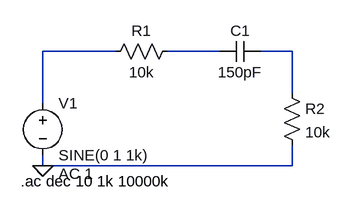
[diagram p0: schematic Draft1.asc]
Draft1.asc, the LTspice schematic file:
Version 4
SHEET 1 880 680
WIRE 16 -80 -96 -80
WIRE 176 -80 96 -80
WIRE 288 -80 240 -80
WIRE 288 -16 288 -80
WIRE -96 0 -96 -80
WIRE -96 96 -96 80
WIRE 288 96 288 64
WIRE 288 96 -96 96
FLAG -96 96 0
SYMBOL res 112 -96 R90
WINDOW 0 0 56 VBottom 2
WINDOW 3 32 56 VTop 2
SYMATTR InstName R1
SYMATTR Value 10k
SYMBOL res 272 -32 R0
SYMATTR InstName R2
SYMATTR Value 10k
SYMBOL voltage -96 -16 R0
WINDOW 123 24 124 Left 2
WINDOW 39 0 0 Left 0
SYMATTR InstName V1
SYMATTR Value SINE(0 1 1k)
SYMATTR Value2 AC 1
SYMBOL cap 240 -96 R90
WINDOW 0 0 32 VBottom 2
WINDOW 3 32 32 VTop 2
SYMATTR InstName C1
SYMATTR Value 150pF
TEXT -130 120 Left 2 !.ac dec 10 1k 10000k

The netlist it stands for:
* Draft1.asc
R1 N002 N001 10k
R2 N003 0 10k
V1 N001 0 SINE(0 1 1k) AC 1
C1 N003 N002 150pF
.ac dec 10 1k 10000k
.backanno
.end